# Altium schematic sheet VU_LED.SchDoc
size A4; Organization: Altium Limited; Address1: L3, 12a Rodborough Rd; Address2: Frenchs Forest; Address3: NSW; Address4: Australia 2086
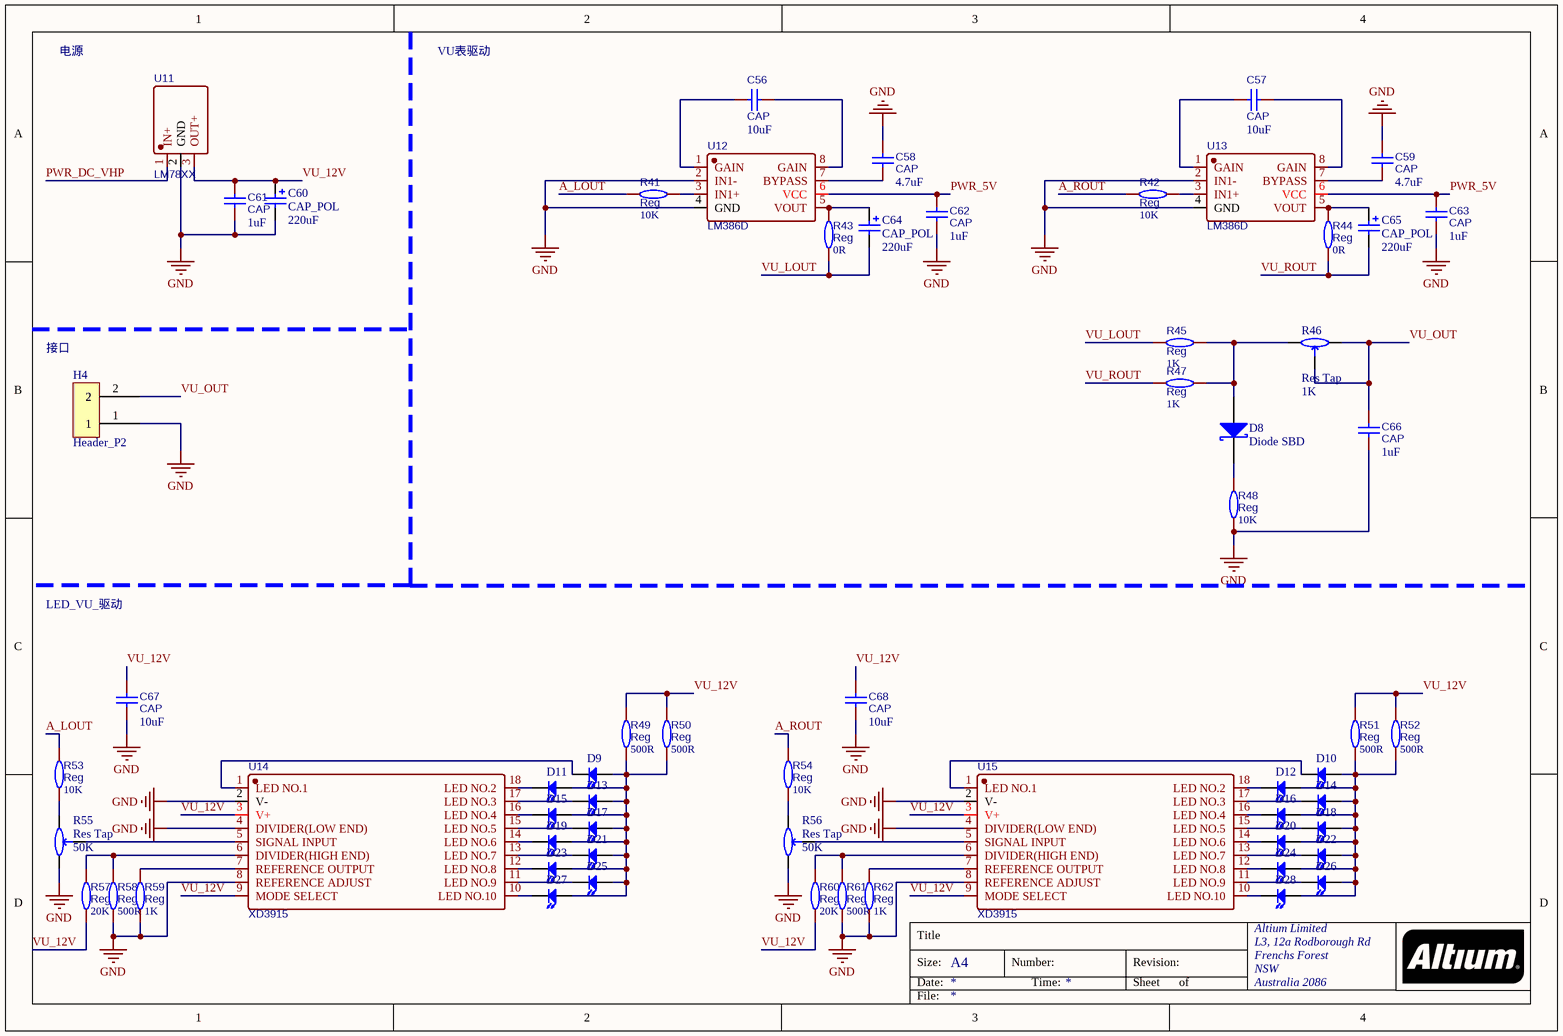
[diagram p0: VU_LED.SchDoc]

## Parts
C56  CAP  value 10uF  [C0603]
C57  CAP  value 10uF  [C0603]
C58  CAP  value 4.7uF  [C0603]
C59  CAP  value 4.7uF  [C0603]
C60  CAP_POL  value 220uF  [CAP_SMD_6.3mm]
C61  CAP  value 1uF  [C0603]
C62  CAP  value 1uF  [C0603]
C63  CAP  value 1uF  [C0603]
C64  CAP_POL  value 220uF  [CAP_SMD_6.3mm]
C65  CAP_POL  value 220uF  [CAP_SMD_6.3mm]
C66  CAP  value 1uF  [C0603]
C67  CAP  value 10uF  [C0603]
C68  CAP  value 10uF  [C0603]
D8  Diode SBD  [SMA_L4.3]
D9  LED  [LED0603_Side]  (value not drawn)
D10  LED  [LED0603_Side]  (value not drawn)
D11  LED  [LED0603_Side]  (value not drawn)
D12  LED  [LED0603_Side]  (value not drawn)
D13  LED  [LED0603_Side]  (value not drawn)
D14  LED  [LED0603_Side]  (value not drawn)
D15  LED  [LED0603_Side]  (value not drawn)
D16  LED  [LED0603_Side]  (value not drawn)
D17  LED  [LED0603_Side]  (value not drawn)
D18  LED  [LED0603_Side]  (value not drawn)
D19  LED  [LED0603_Side]  (value not drawn)
D20  LED  [LED0603_Side]  (value not drawn)
D21  LED  [LED0603_Side]  (value not drawn)
D22  LED  [LED0603_Side]  (value not drawn)
D23  LED  [LED0603_Side]  (value not drawn)
D24  LED  [LED0603_Side]  (value not drawn)
D25  LED  [LED0603_Side]  (value not drawn)
D26  LED  [LED0603_Side]  (value not drawn)
D27  LED  [LED0603_Side]  (value not drawn)
D28  LED  [LED0603_Side]  (value not drawn)
H4  Header_P2  [H_2.54_P2]
R41  Reg  value 10K  [R0603]
R42  Reg  value 10K  [R0603]
R43  Reg  value 0R  [R0603]
R44  Reg  value 0R  [R0603]
R45  Reg  value 1K  [R0603]
R46  Res Tap  value 1K  [RES_TAP_HOR]
R47  Reg  value 1K  [R0603]
R48  Reg  value 10K  [R0603]
R49  Reg  value 500R  [R0603]
R50  Reg  value 500R  [R0603]
R51  Reg  value 500R  [R0603]
R52  Reg  value 500R  [R0603]
R53  Reg  value 10K  [R0603]
R54  Reg  value 10K  [R0603]
R55  Res Tap  value 50K  [RES_TAP_HOR]
R56  Res Tap  value 50K  [RES_TAP_HOR]
R57  Reg  value 20K  [R0603]
R58  Reg  value 500R  [R0603]
R59  Reg  value 1K  [R0603]
R60  Reg  value 20K  [R0603]
R61  Reg  value 500R  [R0603]
R62  Reg  value 1K  [R0603]
U11  LM78XX  [TO-220-3_2.54_HOR]
U12  LM386D  [SOP-8]
U13  LM386D  [SOP-8]
U14  XD3915  [DIP-18]
U15  XD3915  [DIP-18]

## Nets
GND: C58.1 C59.1 C60.2 C61.2 C62.2 C63.2 C66.2 C67.2 C68.2 H4.1 R48.2 R55.2(B) R56.2(B) R58.2 R59.2 R61.2 R62.2 U11.2(GND) U12.2(IN1-) U12.4(GND) U13.2(IN1-) U13.4(GND) U14.2(V-) U14.4(DIVIDER(LOW_END)) U14.8(REFERENCE_ADJUST) U15.2(V-) U15.4(DIVIDER(LOW_END)) U15.8(REFERENCE_ADJUST)
A_LOUT: R41.2 R53.2
A_ROUT: R42.2 R54.2
PWR_5V: C62.1 C63.1 U12.6(VCC) U13.6(VCC)
PWR_DC_VHP: U11.1(IN+)
VU_12V: C60.1 C61.1 C67.1 C68.1 R49.2 R50.2 R51.2 R52.2 R57.2 R60.2 U11.3(OUT+) U14.3(V+) U14.9(MODE_SELECT) U15.3(V+) U15.9(MODE_SELECT)
VU_LOUT: C64.2 R43.2 R45.2
VU_OUT: C66.1 H4.2 R46.1(A) R46.3(TAP)
VU_ROUT: C65.2 R44.2 R47.2
NetC56_1: C56.1 U12.1(GAIN)
NetC56_2: C56.2 U12.8(GAIN)
NetC57_1: C57.1 U13.1(GAIN)
NetC57_2: C57.2 U13.8(GAIN)
NetC58_2: C58.2 U12.7(BYPASS)
NetC59_2: C59.2 U13.7(BYPASS)
NetC64_1: C64.1 R43.1 U12.5(VOUT)
NetC65_1: C65.1 R44.1 U13.5(VOUT)
NetD8_1: D8.1(K) R48.1
NetD8_2: D8.2(A) R45.1 R46.2(B) R47.1
NetD9_1: D9.1(K) U14.1(LED_NO.1)
NetD9_2: D9.2(A) D11.2(A) D13.2(A) D15.2(A) D17.2(A) D19.2(A) D21.2(A) D23.2(A) D25.2(A) D27.2(A) R49.1 R50.1
NetD10_1: D10.1(K) U15.1(LED_NO.1)
NetD10_2: D10.2(A) D12.2(A) D14.2(A) D16.2(A) D18.2(A) D20.2(A) D22.2(A) D24.2(A) D26.2(A) D28.2(A) R51.1 R52.1
NetD11_1: D11.1(K) U14.18(LED_NO.2)
NetD12_1: D12.1(K) U15.18(LED_NO.2)
NetD13_1: D13.1(K) U14.17(LED_NO.3)
NetD14_1: D14.1(K) U15.17(LED_NO.3)
NetD15_1: D15.1(K) U14.16(LED_NO.4)
NetD16_1: D16.1(K) U15.16(LED_NO.4)
NetD17_1: D17.1(K) U14.15(LED_NO.5)
NetD18_1: D18.1(K) U15.15(LED_NO.5)
NetD19_1: D19.1(K) U14.14(LED_NO.6)
NetD20_1: D20.1(K) U15.14(LED_NO.6)
NetD21_1: D21.1(K) U14.13(LED_NO.7)
NetD22_1: D22.1(K) U15.13(LED_NO.7)
NetD23_1: D23.1(K) U14.12(LED_NO.8)
NetD24_1: D24.1(K) U15.12(LED_NO.8)
NetD25_1: D25.1(K) U14.11(LED_NO.9)
NetD26_1: D26.1(K) U15.11(LED_NO.9)
NetD27_1: D27.1(K) U14.10(LED_NO.10)
NetD28_1: D28.1(K) U15.10(LED_NO.10)
NetR41_1: R41.1 U12.3(IN1+)
NetR42_1: R42.1 U13.3(IN1+)
NetR53_1: R53.1 R55.1(A)
NetR54_1: R54.1 R56.1(A)
NetR55_3: R55.3(TAP) U14.5(SIGNAL_INPUT)
NetR56_3: R56.3(TAP) U15.5(SIGNAL_INPUT)
NetR57_1: R57.1 R58.1 U14.6(DIVIDER(HIGH_END))
NetR59_1: R59.1 U14.7(REFERENCE_OUTPUT)
NetR60_1: R60.1 R61.1 U15.6(DIVIDER(HIGH_END))
NetR62_1: R62.1 U15.7(REFERENCE_OUTPUT)

## Notes on the sheet
- 电源
- VU表驱动
- 接口
- LED_VU_驱动
- Title
- Size:
- Date:
- A4
- Number:
- Time:
- Revision:
- Sheet
- of
- File:

## Library data of the parts
C56-C59 C61-C63 C66-C68 = CAP: BOM_Manufacturer: Huaxin S&T; BOM_Manufacturer Part: 0603B103K101CT; nameAlias: Capacitance; Contributor: LCSC; BOM_Supplier: LCSC; BOM_Supplier Part: C302008; spicePre: C; spiceSymbolName: 0603B103K101CT
C60 C64 C65 = CAP_POL: 极性电容
D8 = Diode SBD: Schottky Rectifier; Note: Terminal 2 is the TAB and is electrically connected to the cathode; Published: 8-Jun-2000; LatestRevisionDate: 17-Jul-2002; LatestRevisionNote: Re-released for DXP Platform.; DatasheetVersion: PD-2.057B; PackageVersion: Feb-1998; PackageReference: TO-220AC; Publisher: Altium Limited; PackageDescription: TO, Thru-Hole, Vertical, Heatsink Mounted; 3 In-Line Leads (1 Absent); Pitch 2.54 mm; ComponentLink1Description: Manufacturer Link; ComponentLink1URL: http://www.irf.com/; ComponentLink2Description: Datasheet; ComponentLink2URL: http://www.irf.com/product-info/datasheets/data/10tq.pdf
D9-D28 = LED0: Published: 8-Jun-2000; LatestRevisionDate: 08-Jul-2005; LatestRevisionNote: Mech Layer 1 removed.; PackageReference: LED-0; Publisher: Altium Limited; PackageDescription: LED; 2 Leads
H4 = Header_P2: 2Pin排针
R41-R45 R47-R54 R57-R62 = Res: 电阻; BOM_Manufacturer: Viking Tech; BOM_Manufacturer Part: AR03BTCX1002A; nameAlias: Resistance (Ohms); Contributor: LCSC; BOM_Supplier: LCSC; BOM_Supplier Part: C465721; spicePre: R; spiceSymbolName: AR03BTCX1002A
R46 R55 R56 = Res Tap: 可调电阻; Sim Note: Enter the Resistance value and the set point into parameter fields.; Set Position: 0.5; Published: 24-Mar-1999; LatestRevisionDate: 17-Jul-2002; LatestRevisionNote: Re-released for DXP Platform.; PackageReference: VR3; Publisher: Altium Limited; PackageDescription: Variable Resistor, Thru-Hole; 3 Leads
U11 = LM78XX: 三端稳压(正电压); BOM_Manufacturer: HGSEMI(华冠); BOM_Manufacturer Part: LM7812T; Contributor: LCSC; BOM_Supplier: LCSC; BOM_Supplier Part: C2902509; BOM_JLCPCB Part Class: Extended Part; spicePre: U; spiceSymbolName: LM7812T
U12 U13 = LM386D: LM386; BOM_Manufacturer: HTC Korea TAEJIN Tech; Contributor: LCSC; BOM_Supplier: LCSC; BOM_Supplier Part: C510560; BOM_Manufacturer Part: LM386D; BOM_JLCPCB Part Class: Extended Part; spicePre: U; spiceSymbolName: LM386D
U14 U15 = LM3915: 电平指示; BOM_Manufacturer: XINLUDA(信路达); Contributor: LCSC; BOM_Supplier: LCSC; BOM_Supplier Part: C609778; BOM_Manufacturer Part: XD3915; BOM_JLCPCB Part Class: Extended Part; Frequency: -; spicePre: U; spiceSymbolName: XD3915